# EAGLE design LB_BIT_o2_LONGLED-v02(rev1) (EAGLE 6.6.0)
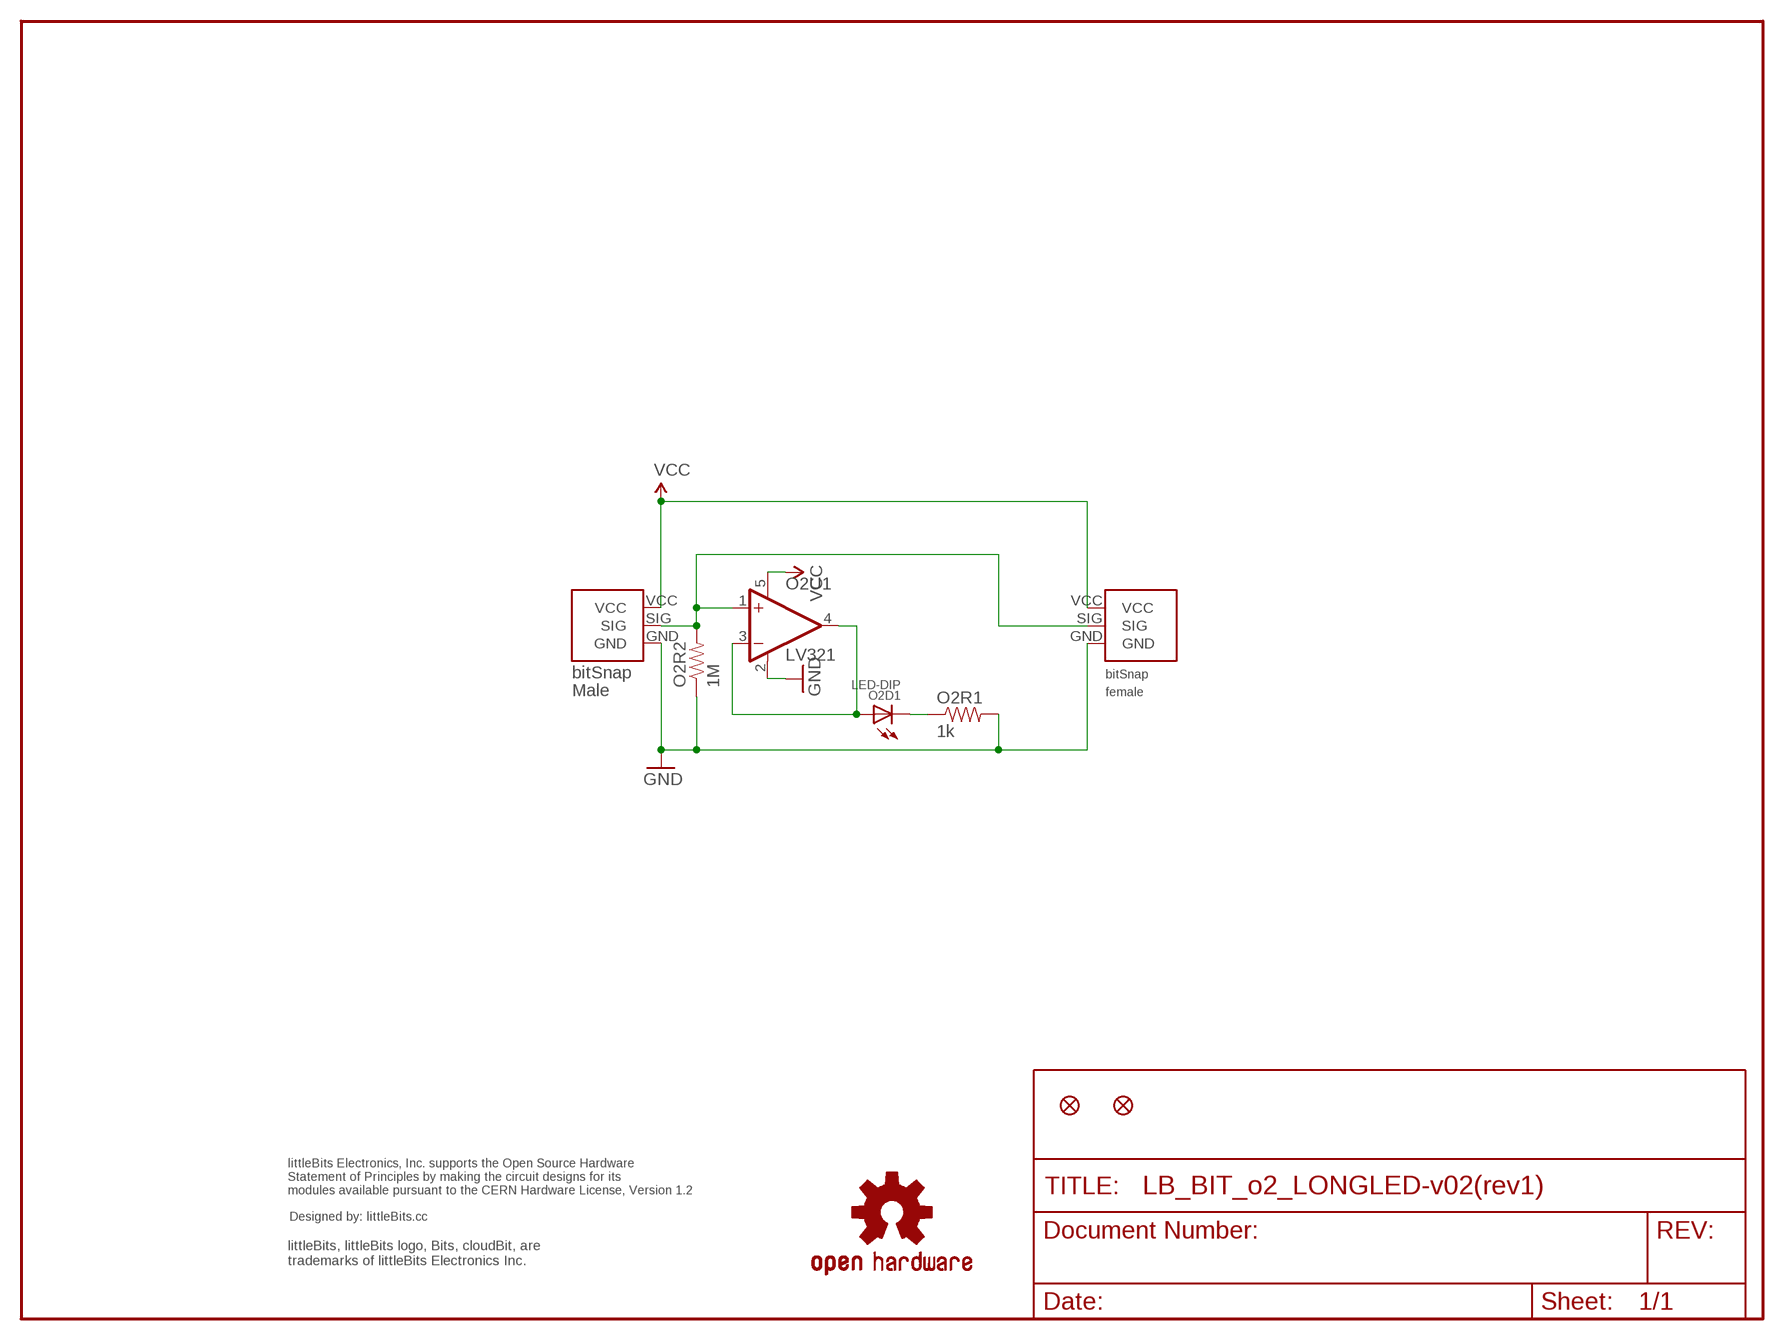
[diagram p0: schematic, sheet 1]

## Parts
O2BSF  BITSNAP_FEMALE  [BITSNAP_FEMALE]
O2BSM  BITSNAP_MALE  [BITSNAP_MALE]
O2D1  LED-DIP  [LED-DIP]
O2FD1  FIDUCIAL1X2  [FIDUCIAL-1X2]
O2FD2  FIDUCIAL1X2  [FIDUCIAL-1X2]
O2R1  1k  RESISTOR0603-RES  [0603-RES]
O2R2  1M  RESISTOR0603-RES  [0603-RES]
O2U1  LV321  [SC70-5]
U$5  OSHWCREDIT  [OSHWCREDIT]
U$14  OSHW-LOGOL  [OSHW-LOGO-L]

## Nets
GND: O2BSF.GND O2BSM.GND O2R1.2 O2R2.1 O2U1.2(V-)
N$4: O2D1.C O2R1.1
N$6: O2BSF.SIG O2BSM.SIG O2R2.2 O2U1.1(+IN)
N$8: O2D1.A O2U1.3(-IN) O2U1.4(OUT)
VCC: O2BSF.VCC O2BSM.VCC O2U1.5(V+)

## Library data of the parts
O2BSF = bitSnap:BITSNAP_FEMALE
O2BSM = bitSnap:BITSNAP_MALE
O2D1 = LITTLEBITS:LED-DIP
O2FD1 O2FD2 = SparkFun:FIDUCIAL: Fiducial Alignment Points Various fiducial points for machine vision alignment.
O2R1 O2R2 = SparkFun:RESISTOR: Resistor Basic schematic elements and footprints for 0603, 1206, and PTH 1/10th watt (small) resistors.
O2U1 = LITTLEBITS:LV321
U$5 = LITTLEBITS:OSHWCREDIT
U$14 = SparkFun_NEW:OSHW-LOGO: Open Source Hardware Logo This logo indicates the piece of hardware it is found on incorporates a OSHW license and/or adheres to the definition of open source hardware found here: http://freedomdefined.org/OSHW

## Board
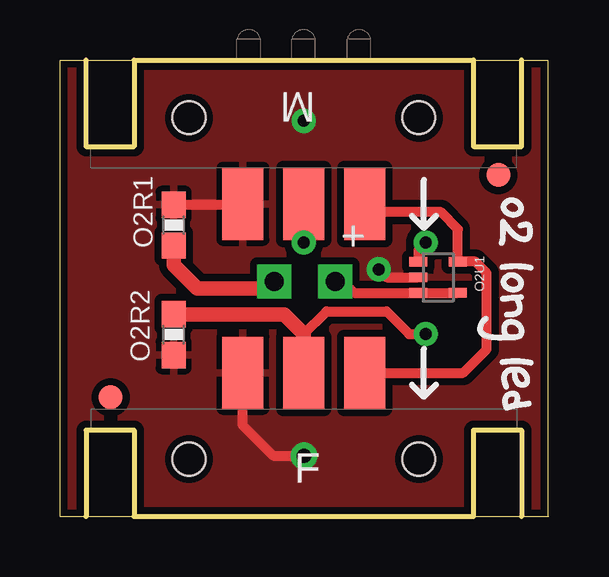
[diagram p1: board, top side]
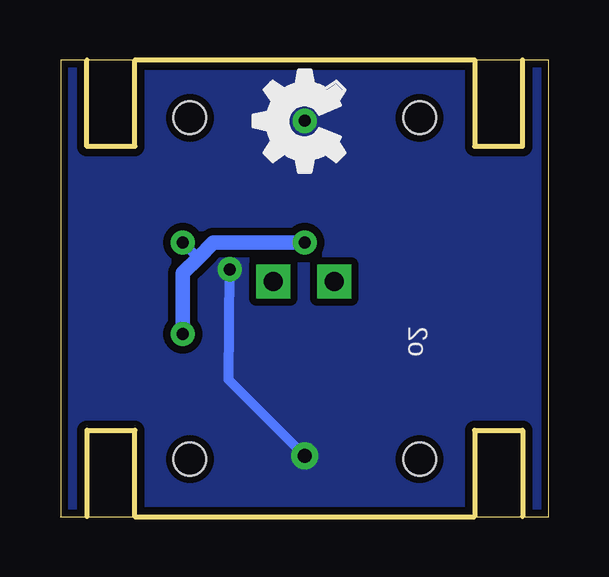
[diagram p2: board, bottom side, seen from below]

Size 20.36 x 19.05 mm. Coordinates in mm from the lower left corner, seen from the top.
Outline: 20.36,0 20.32,0
Outline: 20.32,0 0,0 0,19.05 20.32,19.05 20.32,0
Copper layers (1*16): Top 0.035mm / dielectric 1.5mm / Bottom 0.035mm
Design rules "default": minimum track width 8mil, minimum drill 20mil, track to track 8mil, track to pad 8mil, pad to pad 8mil, via to via 8mil, smd to smd 8mil, copper to edge 10mil, drill to drill 8mil, minimum pad ring 12mil, minimum via ring 10mil, stop-mask expansion 4mil, vias tented up to drill 25mil, thermal gap 10mil

### Footprints (pad centres in the part's own frame; a part is rotated, then mirrored left to right if it is on the bottom)
BITSNAP_FEMALE = smd 1.7 x 3: GND 6.35,6; SIG 8.89,6; VCC 11.43,6 | hole 1.37: 13.68,2.41; 4.1,2.41
BITSNAP_MALE = smd 1.7 x 3: GND 11.43,6; SIG 8.89,6; VCC 6.35,6 | hole 1.37: 13.68,2.41; 4.1,2.41
LED-DIP = drill 0.8 square: A -1.27,0; C 1.27,0
FIDUCIAL-1X2 = smd 1 x 1: 1 0,0
0603-RES = smd 1.1 x 1: 1 -0.85,0; 2 0.85,0
SC70-5 = smd 0.4 x 0.75: 1 -0.65,-0.825; 2 0,-0.825; 3 0.65,-0.825; 4 0.65,0.825; 5 -0.65,0.825

### Placement (x,y rotation side)
O2BSF  1.27,0 0 top
O2BSM  19.05,19.05 180 top
O2D1  10.2,9.81 180 top
O2FD1  18.26,14.25 0 top
O2FD2  2.11,4.98 0 top
O2R1  4.74,12.16 90 top
O2R2  4.74,7.59 90 top
O2U1  15.76,9.99 270 top
U$1  [O]  18.29,13.49 270 top
U$2  [2]  18.14,12.57 270 top
U$3  [L]  18.21,10.67 270 top
U$4  [O]  18.29,10.36 270 top
U$5  -19.05,-24.13 0 top  (outside the outline)
U$7  [OSHW_FILLX150_NOTEXT]  8.49,13.54 0 top
U$9  [N]  18.29,9.3 270 top
U$10  [G]  17.37,8.53 270 top
U$11  [L]  18.21,6.71 270 top
U$12  [E]  18.21,6.48 270 top
U$13  [D]  18.29,5.33 270 top
U$14  -15.24,-11.43 0 top  (outside the outline)

### Tracks (layer width: path | path; a pad name or v marks a point on that pad's centre or on a via)
GND  (via drill 0.5, 0.6)
  Top 0.406: O2R1.2 7.58,13.01 O2BSM.GND | 13.46,10.15 v13.28,10.32 13.62,9.99 O2U1.2 | v10.16,2.54 8.89,2.54 7.62,3.81 O2BSF.GND
  Bottom 0.406: v13.28,10.32 13.34,5.71 v10.16,2.54
  other vias: 10.16,16.51
  pour Top (isolate 0.305): 0.32,18.73 20,18.73 20,0.32 0.32,0.32
  pour Bottom (isolate 0.305): 0.32,18.73 20,18.73 20,0.32 0.32,0.32
N$4
  Top 0.61: O2R1.1 4.74,10.5 5.71,9.53 8.64,9.53 O2D1.C
N$6  (via drill 0.5)
  Top 0.406: 10.16,7.62 11.09,8.55 11.1,8.56 13.61,8.56 14.55,7.62 v15.24,7.62 | O2U1.1 14.93,11.12 v15.24,11.43
  Top 0.61: O2R2.2 9.34,8.44 10.16,7.62 O2BSF.SIG | v10.16,11.43 O2BSM.SIG
  Bottom 0.406: 14.61,10.79 v15.24,11.43
  Bottom 0.61: v10.16,11.43 13.97,11.43 14.61,10.79 15.24,10.16 v15.24,7.62
N$8
  Top 0.406: O2D1.A 11.5,9.84 11.75,9.84 12.25,9.34 O2U1.3 O2U1.4
VCC
  Top 0.406: O2BSF.VCC 16.8,6 17.78,6.99 17.78,10.16 17.3,10.64 O2U1.5 16.58,11.99 15.88,12.7 13.05,12.7 O2BSM.VCC

### Text on the board
_bsilk: o2